# EAGLE design sensor_v21 (EAGLE 7.7.0)
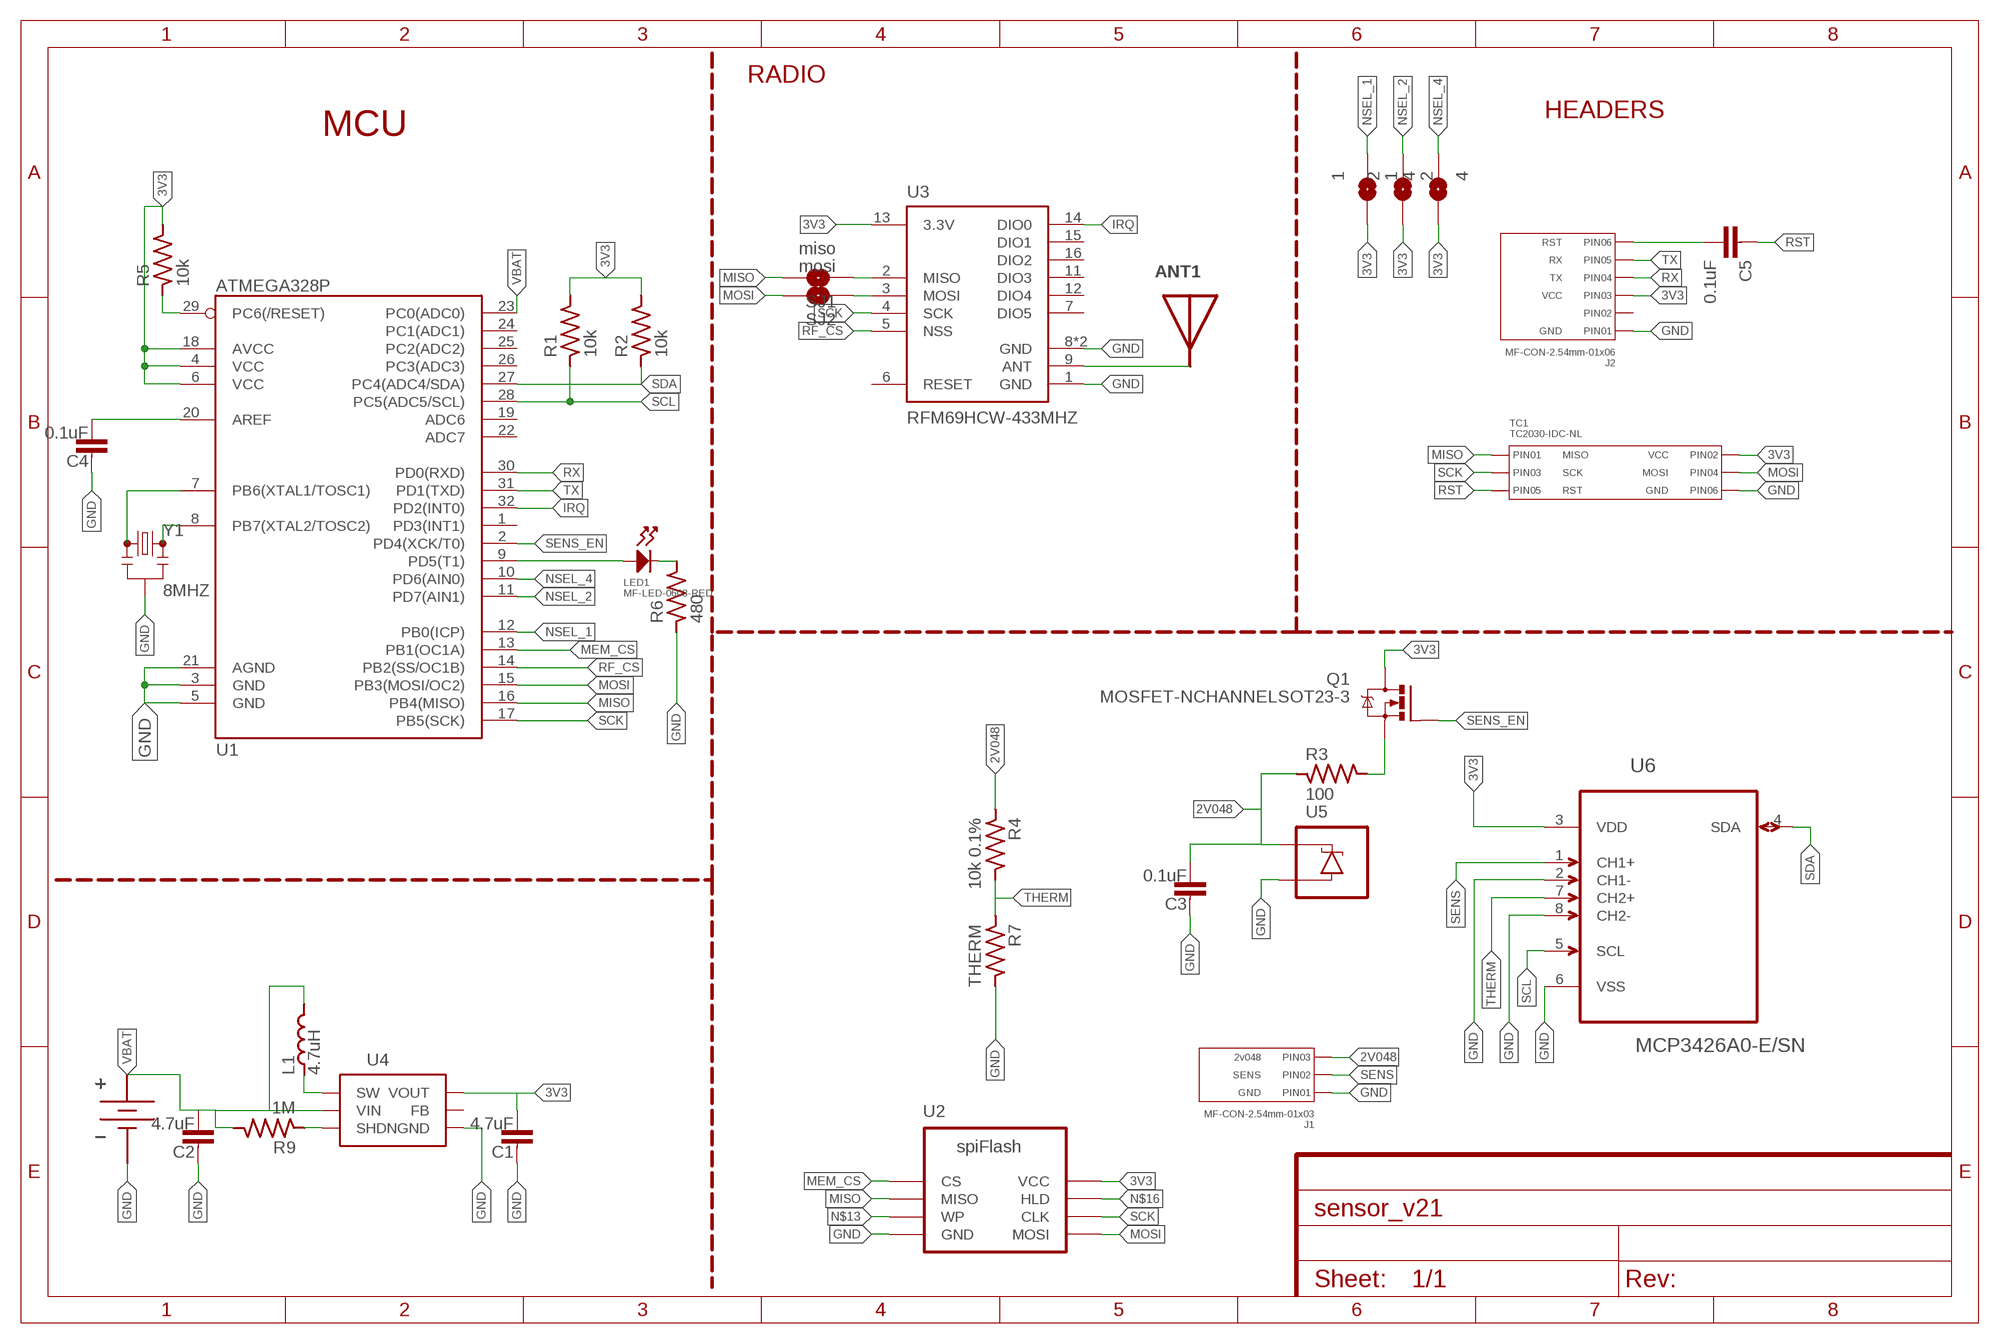
[diagram p0: schematic, sheet 1]

## Parts
1  1  SOLDERJUMPERNC2  [SJ_2S-NOTRACE]
2  2  SOLDERJUMPERNC2  [SJ_2S-NOTRACE]
4  4  SOLDERJUMPERNC2  [SJ_2S-NOTRACE]
ANT1  ANTENNA-433_CHIP  [ANT_433_CHIP]
C1  4.7uF  CAPACITOR_NP0603-N  [C0603-N]
C2  4.7uF  CAPACITOR_NP0603-N  [C0603-N]
C3  0.1uF  CAPACITOR_NP0603-N  [C0603-N]
C4  0.1uF  CAPACITOR_NP0603-N  [C0603-N]
C5  0.1uF  CAPACITOR0603-N  [C0603-N]
J1  MF-CON-2.54mm-01x03  CON_01X03_PTH_2.54MM  [PTH_2.54MM_01X03]
J2  MF-CON-2.54mm-01x06  CON_01X06_PTH_2.54MM  [PTH_2.54MM_01X06]
L1  4.7uH  INDUCTOR3030  [L3030]
LED1  MF-LED-0603-RED  LED_SINGLE-0603-RED  [LED0603]
Q1  MOSFET-NCHANNELSOT23-3  [SOT23-3]
R1  10k  RESISTOR0603-N  [R0603-N]
R2  10k  RESISTOR0603-N  [R0603-N]
R3  100  RESISTOR0603-N  [R0603-N]
R4  10k 0.1%  RESISTOR0603-N  [R0603-N]
R5  10k  RESISTOR0603-N  [R0603-N]
R6  480  RESISTOR0603-N  [R0603-N]
R7  THERM  RESISTOR0603-N  [R0603-N]
R9  1M  RESISTOR0603-N  [R0603-N]
SJ1  miso  SOLDERJUMPERNC2  [SJ_2S-NOTRACE]
SJ2  mosi  SOLDERJUMPERNC2  [SJ_2S-NOTRACE]
TC1  TC2030-IDC-NL  CON_02X03_AVRISP_TC2030-IDC-NL  [TC2030-IDC-NL]
U1  ATMEGA328P  ATMEGA328P_SMD-AU  [TQFP32]
U2  WINBOND_FLASH_4MBIT-SOIC  [SOIC8]
U3  RFM69HCW-433MHZ  [RFM69HCW-XXXS2]
U4  AAT1217-SOT23-6  [SOT23-6]
U5  LM4040-SOT-23-3  [SOT23-3]
U6  MCP3426A0-E/SN  [SOIC127P600X175-8N]
U$1  KEYSTONEAAHOLDER_2CELL  [KEYSTONEAAHOLDER_2CELL]
Y1  8MHZ  RESONATOR8MHZ  [RESONATOR-SMD]

## Nets
2V048: C3.2 J1.P$3(PIN3) R3.1 R4.1 U5.1(C)
3V3: 1.2 2.2 4.2 C1.2 J2.P$3(PIN3) Q1.3(D) R1.2 R2.2 R5.2 TC1.P$2(PIN2) U1.4(VCC) U1.6(VCC) U1.18(AVCC) U2.8(VCC) U3.13(3.3V) U4.5(VOUT) U6.3(VDD)
GND: C1.1 C2.1 C3.1 C4.1 J1.P$1(PIN1) J2.P$1(PIN1) R6.1 R7.2 TC1.P$6(PIN6) U1.3(GND) U1.5(GND) U1.21(AGND) U2.4(GND) U3.1(GND) U3.8(GND) U3.10(GND) U4.2(GND) U5.2(A) U6.2(CH1-) U6.6(VSS) U6.8(CH2-) U$1.P$2(GND) Y1.2
IRQ: U1.32(PD2(INT0)) U3.14(DIO0)
MEM_CS: U1.13(PB1(OC1A)) U2.1(CS)
MISO: SJ1.2 TC1.P$1(PIN1) U1.16(PB4(MISO)) U2.2(MISO)
MOSI: SJ2.2 TC1.P$4(PIN4) U1.15(PB3(MOSI/OC2)) U2.5(MOSI)
N$1: R9.1 U4.4(SHDN)
N$2: ANT1.1 U3.9(ANT)
N$3: LED1.ANODE U1.9(PD5(T1))
N$4: C4.2 U1.20(AREF)
N$5: LED1.CATHODE R6.2
N$6: L1.P$1 U4.1(SW)
N$7: U1.7(PB6(XTAL1/TOSC1)) Y1.1
N$8: U1.8(PB7(XTAL2/TOSC2)) Y1.3
N$9: SJ1.1 U3.2(MISO)
N$10: C5.2 J2.P$6(PIN6)
N$11: SJ2.1 U3.3(MOSI)
N$12: Q1.2(S) R3.2
N$13: U2.3(WP)
N$16: U2.7(HLD)
NSEL_1: 1.1 U1.12(PB0(ICP))
NSEL_2: 2.1 U1.11(PD7(AIN1))
NSEL_4: 4.1 U1.10(PD6(AIN0))
RF_CS: U1.14(PB2(SS/OC1B)) U3.5(NSS)
RST: C5.1 R5.1 TC1.P$5(PIN5) U1.29(PC6(/RESET))
RX: J2.P$4(PIN4) U1.30(PD0(RXD))
SCK: TC1.P$3(PIN3) U1.17(PB5(SCK)) U2.6(CLK) U3.4(SCK)
SCL: R1.1 U1.28(PC5(ADC5/SCL)) U6.5(SCL)
SDA: R2.1 U1.27(PC4(ADC4/SDA)) U6.4(SDA)
SENS: J1.P$2(PIN2) U6.1(CH1+)
SENS_EN: Q1.1(G) U1.2(PD4(XCK/T0))
THERM: R4.2 R7.1 U6.7(CH2+)
TX: J2.P$5(PIN5) U1.31(PD1(TXD))
VBAT: C2.2 L1.P$2 R9.2 U1.23(PC0(ADC0)) U4.6(VIN) U$1.P$1(VBAT)
Unconnected: J2.P$2(PIN2) U1.1(PD3(INT1)) U1.19(ADC6) U1.22(ADC7) U1.24(PC1(ADC1)) U1.25(PC2(ADC2)) U1.26(PC3(ADC3)) U3.6(RESET) U3.7(DIO5) U3.11(DIO3) U3.12(DIO4) U3.15(DIO1) U3.16(DIO2) U4.3(FB)

## Notes on the sheet
- RADIO
- HEADERS
- MCU

## Library data of the parts
1 2 4 SJ1 SJ2 = My_Connectors:SOLDERJUMPER: Solder Jumper Standard SMD solder jumper. Used to automate production. Two varients : Normally Open and Normally Closed are the same, but have different paste layers. NC will have a large amount of paste and should jumper during reflow.
ANT1 = My_RF:ANTENNA; PARTNO: 0433AT62A0020E
C1-C4 = My_Passives:CAPACITOR_NP
C5 = passives-7351:CAPACITOR
J1 = My_Connectors:CON_01X03: Library: MF_Connectors Description: Header Connector with 03 Positions and 01 Rows. Use the LABEL Attribute to label the pin on the schematic and PCB. You can remove the attributes on the PCB by using the SMASH function on the part and then deleting the text.; HOUSEPART: YES; LABEL01: GND; LABEL02: SENS; LABEL03: 2v048; MPN: MF-CON-2.54mm-01x03; PARTNO: 0022053031; POPULATE: 1; URL: https://factory.macrofab.com/part/MF-CON-2.54mm-01x03
J2 = My_Connectors:CON_01X06: Library: MF_Connectors Description: Header Connector with 6 Positions and 01 Rows. Use the LABEL Attribute to label the pin on the schematic and PCB. You can remove the attributes on the PCB by using the SMASH function on the part and then deleting the text.; HOUSEPART: YES; LABEL01: GND; LABEL03: VCC; LABEL04: TX; LABEL05: RX; LABEL06: RST; MPN: MF-CON-2.54mm-01x06; POPULATE: 1; URL: https://factory.macrofab.com/part/MF-CON-2.54mm-01x06
L1 = My_Passives:INDUCTOR
LED1 = My_LEDs:LED_SINGLE: Library: MF_LEDs Description: Device for Single LED Packages. Manufacture part number (MFG#) can be added via Attributes.; HOUSEPART: YES; MPN: MF-LED-0603-RED; POPULATE: 1; URL: https://factory.macrofab.com/part/MF-LED-0603-RED
Q1 = My_Descrete_Semiconductors:MOSFET-NCHANNEL: Common NMOSFET Parts MFG P/N Store ID Prod ID FDD8780 TRANS-09984 SI7820DN TRANS-11055 FDS6630A IC-08089 2N7002PW TRANS-11151 FQP30N06L COM-10213 TRANS-10060 BSS123LT1G TRANS-08345 BSS138 TRANS-00830 BS170 2N7000
R1-R3 R5 R6 R9 = My_Passives:RESISTOR
R4 = My_Passives:RESISTOR; PARTNO: 0.1% !!
R7 = My_Passives:RESISTOR; PARTNO: FIND PART!!
TC1 = My_Connectors:CON_02X03: Library: MF_Connectors Description: Header Connector with 6 Positions and 02 Rows. Use the LABEL Attribute to label the pin on the schematic and PCB. You can remove the attributes on the PCB by using the SMASH function on the part and then deleting the text.; HOUSEPART: NO; LABEL01: MISO; LABEL02: VCC; LABEL03: SCK; LABEL04: MOSI; LABEL05: RST; LABEL06: GND; MPN: TC2030-IDC-NL; PARTNO: NA; POPULATE: 0; URL: http://www.tag-connect.com/AVRISP
U1 = My_IC_Digital:ATMEGA328P_SMD: Atmel 32-pin 8-bit micro 16k flash.
U2 = My_IC_Digital:WINBOND_FLASH_4MBIT
U3 = My_RF:RFM69H; PARTNO: COM-13910; PROD_ID: IC-11997, IC-12053
U4 = My_IC_Power:AAT1217; PARTNO: AAT1217ICA-3.3-T1
U5 = My_Descrete_Semiconductors:LM4040; PARTNO: LM4040AIM3-2.0/NOPB
U6 = Microchip_By_element14_Batch_1:MCP3426A0-E/SN: Analog-to-Digital Converter; MPN: MCP3426A0-E/SN; OC_FARNELL: 1825012; OC_NEWARK: 52R9954; PACKAGE: SOIC-8; SUPPLIER: Microchip
U$1 = _my-parts:KEYSTONEAAHOLDER_2CELL
Y1 = My_xTal:RESONATOR: Resonator Small SMD resonator. Used, eg, on the Arduino Pro/ Pro Mini boards. 8MHz- XTAL-08895 16MHz- XTAL-08900; PARTNO: CSTCE8M00G55-R0; PROD_ID: XTAL-08895

## Board
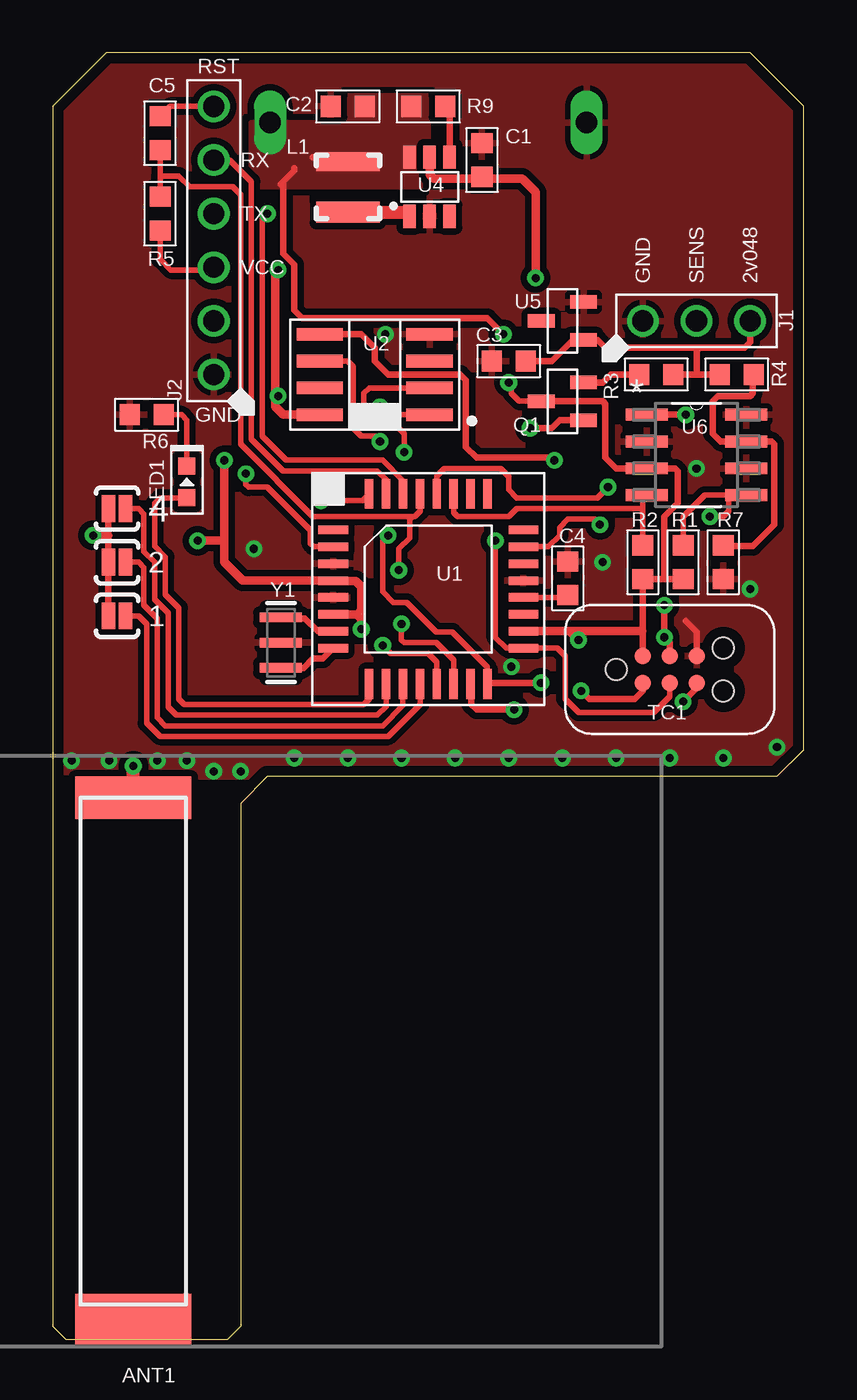
[diagram p1: board, top side]
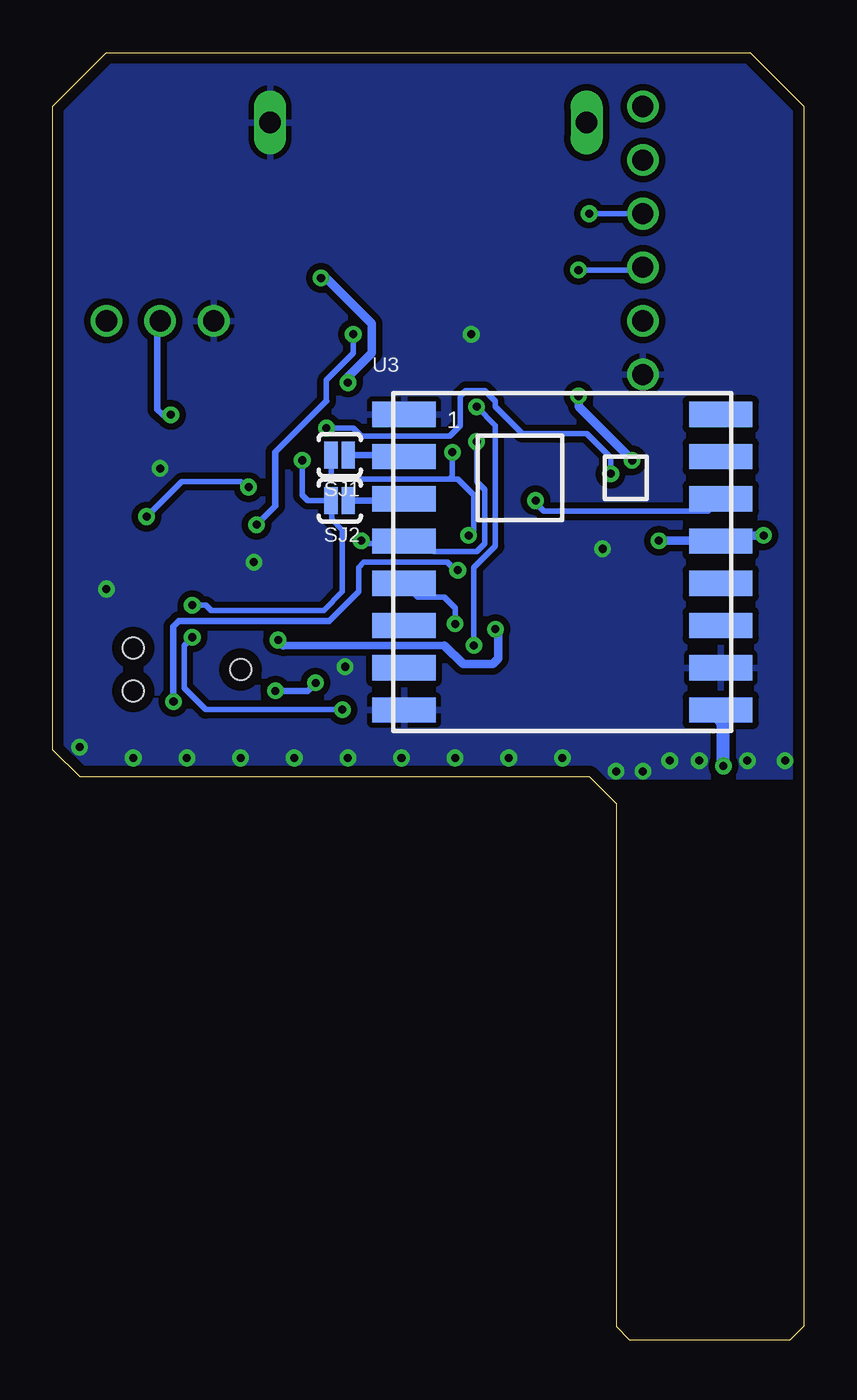
[diagram p2: board, bottom side, seen from below]

Size 35.56 x 60.96 mm. Coordinates in mm from the lower left corner, seen from the top.
Outline: 0,58.42 0,0.64 0.64,0 8.26,0 8.89,0.64 8.89,25.4 10.16,26.67 34.29,26.67 35.56,27.94 35.56,58.42 33.02,60.96 2.54,60.96 0,58.42
Copper layers (1*16): Top 0.0178mm / dielectric 59mil / Bottom 0.0178mm
Design rules "SSC-EAGLE-2Lyr_v1.0.0.3": minimum track width 6mil, minimum drill 14mil, track to track 6mil, track to pad 6mil, pad to pad 6mil, via to via 6mil, smd to smd 6mil, copper to edge 20mil, drill to drill 16mil, minimum pad ring 8mil, minimum via ring 8mil, stop-mask expansion 3mil, vias tented up to drill 0mil, thermal gap 10mil

### Footprints (pad centres in the part's own frame; a part is rotated, then mirrored left to right if it is on the bottom)
SJ_2S-NOTRACE = smd 0.635 x 1.27: 1 -0.401,0; 2 0.413,0
ANT_433_CHIP = smd 5.5 x 2: 1 0,1 | smd 5.5 x 2.5: 2 0,25.75
C0603-N = smd 0.95 x 1: 1 -0.8,0; 2 0.8,0
PTH_2.54MM_01X03 = drill 1: P$1 -2.54,0; P$2 0,0; P$3 2.54,0
PTH_2.54MM_01X06 = drill 1: P$1 -6.35,0; P$2 -3.81,0; P$3 -1.27,0; P$4 1.27,0; P$5 3.81,0; P$6 6.35,0
L3030 = smd 1 x 3: P$1 -1.2,0 | smd 0.9 x 3: P$2 1.2,0
LED0603 = smd 0.8 x 0.8: ANODE 0.75,0; CATHODE -0.75,0
SOT23-3 = smd 0.635 x 1.27: 1 -0.9,-1; 2 0.9,-1; 3 0,1
R0603-N = smd 0.95 x 1: 1 -0.8,0; 2 0.8,0
TC2030-IDC-NL = smd 0.787 x 0.787: P$1 -1.27,-0.635; P$2 -1.27,0.635; P$3 0,-0.635; P$4 0,0.635; P$5 1.27,-0.635; P$6 1.27,0.635 | hole 0.991: 2.54,1.016; 2.54,-1.016; -2.54,0
TQFP32 = smd 1.4 x 0.4: 1 -4.5,2.8; 2 -4.5,2; 3 -4.5,1.2; 4 -4.5,0.4; 5 -4.5,-0.4; 6 -4.5,-1.2; 7 -4.5,-2; 8 -4.5,-2.8; 17 4.5,-2.8; 18 4.5,-2; 19 4.5,-1.2; 20 4.5,-0.4; 21 4.5,0.4; 22 4.5,1.2; 23 4.5,2; 24 4.5,2.8 | smd 0.4 x 1.4: 9 -2.8,-4.5; 10 -2,-4.5; 11 -1.2,-4.5; 12 -0.4,-4.5; 13 0.4,-4.5; 14 1.2,-4.5; 15 2,-4.5; 16 2.8,-4.5; 25 2.8,4.5; 26 2,4.5; 27 1.2,4.5; 28 0.4,4.5; 29 -0.4,4.5; 30 -1.2,4.5; 31 -2,4.5; 32 -2.8,4.5
SOIC8 = smd 2.2 x 0.6: 1 -2.6,1.905; 2 -2.6,0.635; 3 -2.6,-0.635; 4 -2.6,-1.905; 5 2.6,-1.905; 6 2.6,-0.635; 7 2.6,0.635; 8 2.6,1.905
RFM69HCW-XXXS2 = smd 3 x 1.2: 1 -7.5,7; 2 -7.5,5; 3 -7.5,3; 4 -7.5,1; 5 -7.5,-1; 6 -7.5,-3; 7 -7.5,-5; 8 -7.5,-7; 9 7.5,-7; 10 7.5,-5; 11 7.5,-3; 12 7.5,-1; 13 7.5,1; 14 7.5,3; 15 7.5,5; 16 7.5,7
SOT23-6 = smd 0.6 x 1.1: 1 0,0; 2 0.95,0; 3 1.9,0; 4 1.9,2.8; 5 0.95,2.8; 6 0,2.8
SOIC127P600X175-8N = smd 1.981 x 0.559: 1 -2.362,1.905; 2 -2.362,0.635; 3 -2.362,-0.635; 4 -2.362,-1.905; 5 2.362,-1.905; 6 2.362,-0.635; 7 2.362,0.635; 8 2.362,1.905
KEYSTONEAAHOLDER_2CELL = drill 1.016 pad 1.524 long: P$1 -7.493,27.178; P$2 7.493,27.178
RESONATOR-SMD = smd 0.45 x 2: 1 -1.2,0; 2 0,0; 3 1.2,0

### Placement (x,y rotation side)
1  3.05,34.29 180 top
2  3.05,36.83 180 top
4  3.05,39.37 180 top
ANT1  3.81,26.67 180 top
C1  20.32,55.88 270 top
C2  13.97,58.42 0 top
C3  21.59,46.35 0 top
C4  24.38,36.07 270 top
C5  5.08,57.15 90 top
J1  30.48,48.26 0 top
J2  7.62,52.07 90 top
L1  13.97,54.61 90 top
LED1  6.35,40.64 270 top
Q1  24.13,44.45 90 top
R1  29.84,36.83 270 top
R2  27.94,36.83 270 top
R3  28.57,45.72 180 top
R4  32.38,45.72 0 top
R5  5.08,53.34 270 top
R6  4.45,43.81 0 top
R7  31.75,36.83 270 top
R9  17.78,58.42 180 top
SJ1  21.97,41.91 180 bottom
SJ2  21.97,39.75 180 bottom
TC1  29.21,31.75 0 top
U1  17.78,35.56 0 top
U2  15.24,45.72 180 top
U3  11.43,36.83 0 bottom
U4  16.89,53.21 0 top
U5  24.13,48.26 90 top
U6  30.48,41.91 0 top
U$1  17.78,30.48 0 top
Y1  10.79,33.02 270 top

### Tracks (layer width: path | path; a pad name or v marks a point on that pad's centre or on a via)
2V048
  Top 0.305: R3.1 30.48,45.72 | 30.48,45.72 R4.1 | J1.P$3 33.02,47.24 32.77,46.99 30.61,46.99 30.48,46.86 | 30.48,46.86 30.48,45.72 | 30.48,46.86 30.48,46.99 26.16,46.99 25.79,47.36 U5.1 24.63,47.36 23.62,46.35 C3.2
3V3  (via drill 0.38)
  Top 0.254: Q1.3 22.1,44.45 21.72,44.83 21.72,45.21 v21.59,45.34 | 20.07,54.83 C1.2 | R5.2 5.08,51.18 5.59,50.67 7.49,50.67 J2.P$3 | 13.3,35.94 U1.4 | 27.91,33.56 27.94,33.53
  Top 0.305: R1.2 28.96,36.03 | 28.96,36.03 R2.2 27.94,33.53 TC1.P$2 | 28.96,36.03 28.96,38.99 29.59,39.62 29.59,41.15 29.46,41.27 U6.3 26.67,41.27 26.16,41.78 26.16,44.32 26.04,44.45 Q1.3 | 4.2 2.63,38.1 2.2 1.2
  Top 0.406: 10.54,44.58 10.54,44.2 10.92,43.81 U2.8 | v10.67,44.7 10.54,44.58 | U1.4 9,35.96 8.13,36.83 8.13,37.72 | 8.13,37.72 v8.13,41.66 | v6.86,37.85 8,37.85 8.13,37.72 | 27.91,33.56 U1.18 24.48,33.56 v24.89,33.15 | U4.5 17.84,55.18 18.03,54.99 20.23,54.99 C1.2 | 20.07,54.83 20.16,54.83 20.32,54.99 22.23,54.99 22.86,54.36 v22.86,50.29 | U1.6 14.41,34.36 | 14.41,34.36 14.61,34.16 v14.61,33.66 | 13.3,35.94 14.35,35.94 14.61,35.69 14.61,34.56 14.41,34.36 | 10.54,44.58 10.54,50.55 v10.67,50.67 | v1.91,38.1 2.63,38.1
  Bottom 0.254: v10.67,50.67 7.75,50.67 J2.P$3
  Bottom 0.356: 17.02,32.89 24.64,32.89
  Bottom 0.406: v8.13,41.66 10.67,44.2 v10.67,44.7 | v6.86,37.85 3.95,37.85 U3.13 3.66,38.1 v1.91,38.1 | 17.02,32.89 16.13,32 14.73,32 14.48,32.26 14.48,33.53 v14.61,33.66 | 24.64,32.89 v24.89,33.15 | v21.59,45.34 21.59,45.59 20.45,46.74 20.45,48.13 22.61,50.29 v22.86,50.29
GND  (via drill 0.38)
  Top 0.305: TC1.P$6 30.48,33.53 29.97,34.04
  other vias: 30.48,41.27 9.53,37.47 33.02,35.56 26.04,36.83 15.75,47.62 21.72,31.88 34.29,28.07 31.75,27.56 29.21,27.56 26.67,27.56 24.13,27.56 21.59,27.56 19.05,27.56 16.51,27.56 13.97,27.56 11.43,27.56 8.89,26.92 7.62,26.92 6.35,27.43 4.95,27.43 2.67,27.43 0.89,27.43
  pour Top (isolate 0.305, rank 6): -0.51,26.67 35.56,26.67 35.56,63.5 -0.64,63.5
  pour Bottom (isolate 0.305): -0.51,26.67 35.56,26.67 35.56,63.5 -0.64,63.5
IRQ  (via drill 0.38)
  Top 0.254: 14.98,40.39 U1.32 14.67,39.75 v12.7,39.75
  Bottom 0.254: 4.01,39.75 U3.14 4.52,39.24 12.32,39.24 12.7,39.62 v12.7,39.75
MEM_CS  (via drill 0.38)
  Top 0.254: U1.13 18.18,32.11 17.78,32.51 16,32.51 v15.62,32.89 | v15.49,44.2 16,44.2 16.38,43.81 U2.1
  Top 0.305: 17.91,43.75 U2.1
  Bottom 0.254: v15.62,32.89 15.62,36.58 14.61,37.59 14.61,43.31 v15.49,44.2
MISO  (via drill 0.38)
  Top 0.254: U1.16 20.57,31.88 18.92,33.53 18.16,33.53 16.76,34.92 16.13,34.92 15.62,35.43 15.62,37.85 v15.88,38.1 | U2.2 14.99,45.09 14.73,44.83 14.73,43.56 14.99,43.31 16.26,43.31 16.64,42.93 v16.64,42.04
  Top 0.305: TC1.P$1 27.94,30.73 27.56,30.35 25.4,30.35 v25.02,30.73 | v23.11,31.11 20.64,31.11 U1.16
  Bottom 0.254: SJ1.2 22.38,40.93 22.23,40.77 16.76,40.77 | 16.76,40.77 16.38,40.77 15.62,40.01 15.62,38.35 v15.88,38.1 | v16.64,42.04 16.64,40.89 16.76,40.77
  Bottom 0.305: v25.02,30.73 23.5,30.73 v23.11,31.11
MOSI  (via drill 0.38)
  Top 0.305: TC1.P$4 29.21,33.02 v28.96,33.27 v28.96,34.8 | v21.84,29.84 20.07,29.84 19.81,30.1 19.81,31.03 U1.15 | U2.5 14.61,47.62 15.24,46.99 15.24,46.35 15.88,45.72 19.3,45.72 19.56,45.47 19.56,42.29 20.07,41.78 23.62,41.78 v23.75,41.66
  Bottom 0.254: v23.75,41.66 23.75,40.01 23.5,39.75 SJ2.2 22.35,39.72 22.35,38.86 21.84,38.35 21.84,35.43 22.73,34.54 28.07,34.54 28.32,34.8 v28.96,34.8 | v21.84,29.84 28.32,29.84 29.34,30.86 29.34,32.89 v28.96,33.27
N$1
  Top 0.305: U4.4 18.79,58.21 R9.1
N$2  (via drill 0.38)
  Top 0.61: ANT1.1 v3.81,27.18
  Bottom 0.61: v3.81,27.18 3.81,29.21 3.93,29.33 U3.9
N$3
  Top 0.254: U1.9 14.98,30.35 14.73,30.1 6.22,30.1 5.97,30.35 5.97,34.67 5.33,35.31 5.33,37.08 4.83,37.59 4.83,39.62 5.08,39.88 6.34,39.88 LED1.ANODE
N$4
  Top 0.254: U1.20 24.28,35.16 C4.2
N$5
  Top 0.254: LED1.CATHODE 6.35,43.56 6.1,43.81 R6.2
N$6
  Top 0.61: L1.P$1 16.69,53.41 U4.1
N$7
  Top 0.305: U1.7 12.54,33.56 11.94,34.16 10.85,34.16 Y1.1
N$8
  Top 0.305: Y1.3 11.88,31.82 12.32,32.26 12.78,32.26 U1.8
N$9
  Bottom 0.305: SJ1.1 19.01,41.91 U3.2
N$10
  Top 0.254: J2.P$6 5.55,58.42 C5.2
N$11
  Bottom 0.305: SJ2.1 19.01,39.75 U3.3
N$12
  Top 0.305: R3.2 26.42,45.72 26.04,45.34 25.14,45.34 Q1.2
NSEL_1
  Top 0.254: U1.12 17.4,31.04 17.4,30.1 15.88,28.57 5.08,28.57 4.45,29.21 4.45,33.91 4.06,34.29 1.1
NSEL_2
  Top 0.254: U1.11 16.58,30.04 15.62,29.08 5.33,29.08 4.95,29.46 4.95,34.16 4.32,34.8 4.32,36.58 4.06,36.83 2.1
NSEL_4
  Top 0.254: U1.10 15.78,30 15.37,29.59 5.84,29.59 5.46,29.97 5.46,34.42 4.83,35.05 4.83,36.83 4.32,37.34 4.32,39.12 4.06,39.37 4.1
RF_CS  (via drill 0.38)
  Top 0.254: U1.14 18.98,32.2 18.16,33.02 16.64,33.02 16.51,33.15 v16.51,33.91
  Bottom 0.254: v16.51,33.91 16.51,34.67 17.02,35.18 18.28,35.18 U3.5
RST  (via drill 0.38)
  Top 0.254: 17.4,40.04 17.4,39.24 17.14,38.99 17.02,38.99 | 17.02,38.99 12.32,38.99 8.89,42.42 8.89,54.23 8.51,54.61 6.48,54.61 5.97,55.12 5.08,55.12 | 5.08,55.12 R5.1 | C5.1 5.08,55.12 | 17.02,38.99 16.89,38.86 16.89,37.97 16.38,37.47 v16.38,36.45
  Top 0.305: TC1.P$5 30.48,30.86 v29.84,30.23 | 17.4,40.04 U1.29
  Bottom 0.254: 22.48,34.04 21.08,35.43 21.08,36.58 20.83,36.83 16.89,36.83 16.51,36.45 v16.38,36.45
  Bottom 0.305: v29.84,30.23 29.84,33.78 29.59,34.04 22.48,34.04
RX  (via drill 0.38)
  Top 0.254: U1.30 16.58,40.7 15.62,41.66 11.05,41.66 9.91,42.8 9.91,53.09 v10.16,53.34
  Bottom 0.254: v10.16,53.34 J2.P$4
SCK  (via drill 0.38)
  Top 0.254: U2.6 13.97,46.35 14.22,46.1 14.22,43.18 14.61,42.8 15.37,42.8 15.49,42.67 v15.49,42.55 | v20.95,37.85 20.95,33.27 21.46,32.77 U1.17 23.88,32.77 24.26,32.38 24.26,30.35 24.89,29.72 28.45,29.72 29.21,30.48 TC1.P$3
  Bottom 0.254: U3.4 18.02,37.83 17.53,37.34 15.49,37.34 15.11,37.72 15.11,40.26 15.49,40.64 v15.49,42.55 | 19.33,37.72 20.83,37.72 v20.95,37.85
  Bottom 0.305: 19.33,37.72 U3.4 18.79,37.59
SCL  (via drill 0.38)
  Top 0.254: U1.28 18.18,40.91 18.54,41.27 21.21,41.27 21.59,40.89 21.59,40.26 21.97,39.88 25.78,39.88 v26.29,40.39 | R1.1 29.84,38.99 30.86,40.01 32,40.01 | 32,40.01 U6.5 | v31.11,38.99 31.75,38.99 32,39.24 32,40.01
  Bottom 0.254: v26.29,40.39 26.42,40.39 26.67,40.64 29.46,40.64 v31.11,38.99
SDA
  Top 0.254: U1.27 18.98,39.19 19.18,38.99 21.59,38.99 21.97,39.37 27.94,39.37 | 27.94,39.37 27.94,39.83 U6.4 | R2.1 27.94,39.37
SENS  (via drill 0.38)
  Top 0.305: U6.1 v29.97,43.81
  Bottom 0.305: v29.97,43.81 30.35,43.81 30.61,44.07 30.61,48.13 J1.P$2
SENS_EN  (via drill 0.38)
  Top 0.254: U1.2 12.35,37.56 12.19,37.72 12.19,38.35 10.16,40.39 9.27,40.39 9.14,40.51 v9.14,41.02
  Top 0.305: v22.61,43.18 23.62,43.18 24,43.56 25.12,43.56 Q1.1
  Bottom 0.254: v9.14,41.02 9.14,41.78 10.29,42.93 13.34,42.93 14.61,44.2 14.61,44.45 15.11,44.96 16,44.96 16.26,44.7 16.26,43.31 16.76,42.8 20.95,42.8 21.34,43.18 v22.61,43.18
THERM
  Top 0.305: R7.1 31.79,37.59 33.15,37.59 34.16,38.61 34.16,42.42 34.04,42.55 U6.7 31.62,42.55 31.24,42.93 31.24,44.45 31.5,44.7 33.02,44.7 33.15,44.83 33.15,45.68 R4.2
TX
  Top 0.254: U1.31 15.78,40.73 15.37,41.15 10.92,41.15 9.4,42.67 9.4,54.86 8.38,55.88 J2.P$5
VBAT  (via drill 0.38)
  Top 0.254: U1.23 23.46,37.56 24,38.1 24,38.48 24.38,38.86 25.65,38.86 v25.91,38.61
  Top 0.305: 12.32,56.01 13.77,56.01 L1.P$2 | 11.43,55.5 11.43,55.37 10.79,54.74 10.92,54.74 10.92,51.44 11.43,50.93 11.43,48.77 11.81,48.39 20.57,48.39 v21.34,47.62
  Bottom 0.254: 22.61,44.45 22.61,45.47 21.34,46.74 v21.34,47.62
  Bottom 0.305: v25.91,38.61 25.02,39.5 25.02,42.04 22.61,44.45
  pour Top (isolate 0.305, no thermals): 13.97,58.93 13.97,57.66 9.4,57.66 9.4,54.61 17.4,54.61 17.4,56.39 17.78,56.39 17.78,58.93